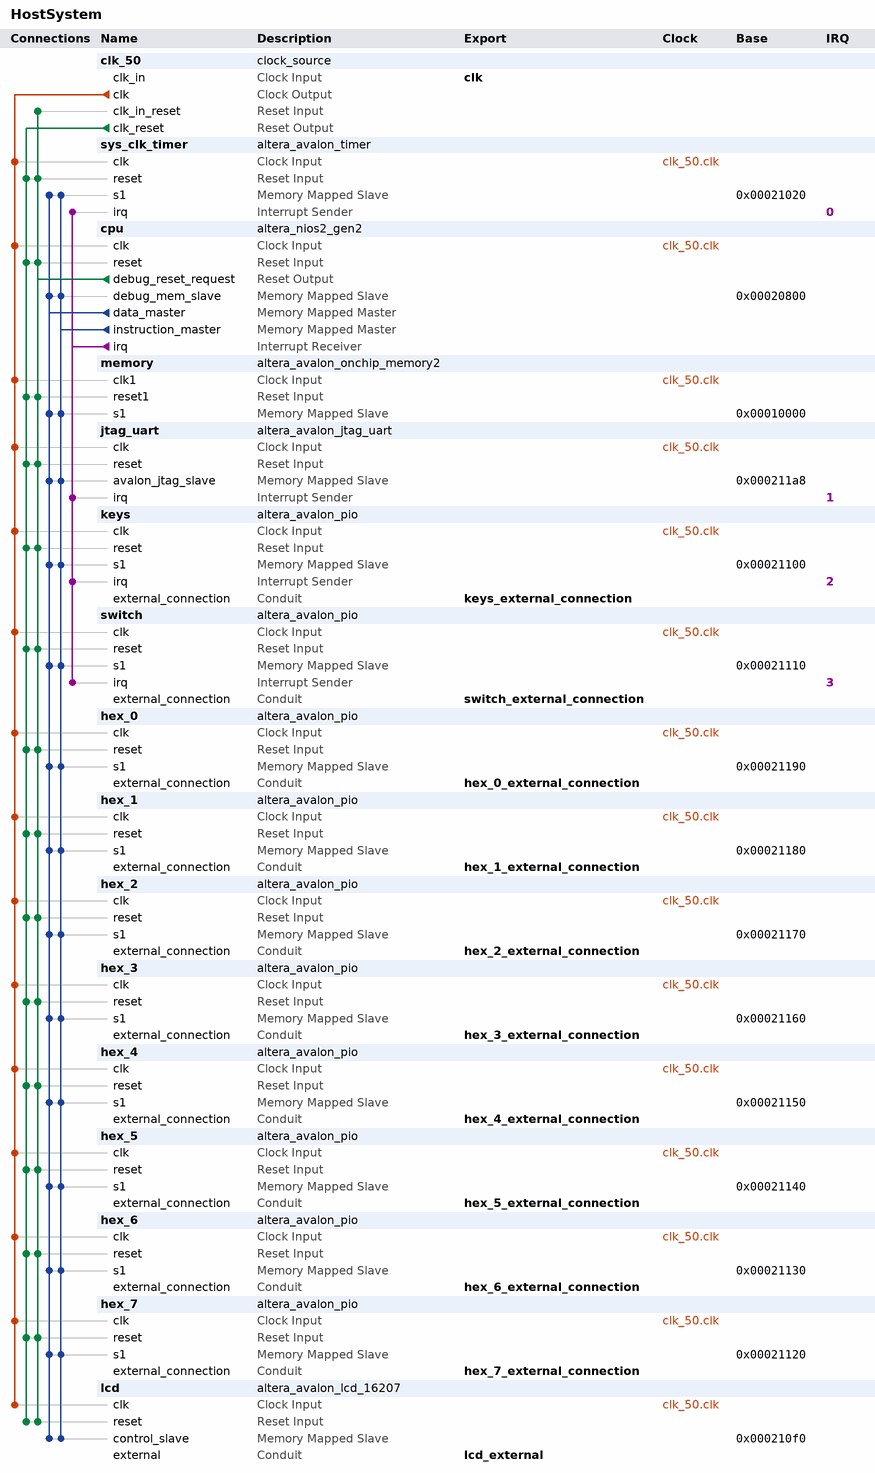
[diagram p0: system contents]
# Platform Designer (Qsys) system HostSystem, Cyclone IV E EP4CE115F29C7
# Parameters at their usual value, and those the tool derives, are not listed.
package require -exact qsys 18.0
create_system HostSystem
set_project_property DEVICE_FAMILY {Cyclone IV E}
set_project_property DEVICE EP4CE115F29C7

add_instance clk_50 clock_source 18.0
set_instance_parameter_value clk_50 clockFrequency 50000000

add_instance sys_clk_timer altera_avalon_timer 18.0
set_instance_parameter_value sys_clk_timer period 1
set_instance_parameter_value sys_clk_timer periodUnits MSEC

add_instance cpu altera_nios2_gen2 18.0
set_instance_parameter_value cpu dcache_size 2048
set_instance_parameter_value cpu exceptionSlave memory.s1
set_instance_parameter_value cpu icache_size 4096
set_instance_parameter_value cpu impl Tiny
set_instance_parameter_value cpu resetSlave memory.s1

add_instance memory altera_avalon_onchip_memory2 18.0
set_instance_parameter_value memory dataWidth 32
set_instance_parameter_value memory dualPort false
set_instance_parameter_value memory initMemContent true
set_instance_parameter_value memory initializationFileName onchip_mem.hex
set_instance_parameter_value memory memorySize 65536

add_instance jtag_uart altera_avalon_jtag_uart 18.0
set_instance_parameter_value jtag_uart simInteractiveOptions NO_INTERACTIVE_WINDOWS

add_instance keys altera_avalon_pio 18.0
set_instance_parameter_value keys direction Input
set_instance_parameter_value keys generateIRQ true
set_instance_parameter_value keys width 4

add_instance switch altera_avalon_pio 18.0
set_instance_parameter_value switch direction Input
set_instance_parameter_value switch generateIRQ true
set_instance_parameter_value switch width 18

add_instance hex_0 altera_avalon_pio 18.0
set_instance_parameter_value hex_0 direction Output
set_instance_parameter_value hex_0 resetValue 5
set_instance_parameter_value hex_0 width 8

add_instance hex_1 altera_avalon_pio 18.0
set_instance_parameter_value hex_1 direction Output
set_instance_parameter_value hex_1 resetValue 5
set_instance_parameter_value hex_1 width 8

add_instance hex_2 altera_avalon_pio 18.0
set_instance_parameter_value hex_2 direction Output
set_instance_parameter_value hex_2 resetValue 5
set_instance_parameter_value hex_2 width 8

add_instance hex_3 altera_avalon_pio 18.0
set_instance_parameter_value hex_3 direction Output
set_instance_parameter_value hex_3 resetValue 5
set_instance_parameter_value hex_3 width 8

add_instance hex_4 altera_avalon_pio 18.0
set_instance_parameter_value hex_4 direction Output
set_instance_parameter_value hex_4 resetValue 5
set_instance_parameter_value hex_4 width 8

add_instance hex_5 altera_avalon_pio 18.0
set_instance_parameter_value hex_5 direction Output
set_instance_parameter_value hex_5 resetValue 5
set_instance_parameter_value hex_5 width 8

add_instance hex_6 altera_avalon_pio 18.0
set_instance_parameter_value hex_6 direction Output
set_instance_parameter_value hex_6 resetValue 5
set_instance_parameter_value hex_6 width 8

add_instance hex_7 altera_avalon_pio 18.0
set_instance_parameter_value hex_7 direction Output
set_instance_parameter_value hex_7 resetValue 5
set_instance_parameter_value hex_7 width 8

add_instance lcd altera_avalon_lcd_16207 18.0

# connections
add_connection clk_50.clk cpu.clk clock
add_connection clk_50.clk hex_0.clk clock
add_connection clk_50.clk hex_1.clk clock
add_connection clk_50.clk hex_2.clk clock
add_connection clk_50.clk hex_3.clk clock
add_connection clk_50.clk hex_4.clk clock
add_connection clk_50.clk hex_5.clk clock
add_connection clk_50.clk hex_6.clk clock
add_connection clk_50.clk hex_7.clk clock
add_connection clk_50.clk jtag_uart.clk clock
add_connection clk_50.clk keys.clk clock
add_connection clk_50.clk lcd.clk clock
add_connection clk_50.clk memory.clk1 clock
add_connection clk_50.clk switch.clk clock
add_connection clk_50.clk sys_clk_timer.clk clock
add_connection clk_50.clk_reset cpu.reset reset
add_connection clk_50.clk_reset hex_0.reset reset
add_connection clk_50.clk_reset hex_1.reset reset
add_connection clk_50.clk_reset hex_2.reset reset
add_connection clk_50.clk_reset hex_3.reset reset
add_connection clk_50.clk_reset hex_4.reset reset
add_connection clk_50.clk_reset hex_5.reset reset
add_connection clk_50.clk_reset hex_6.reset reset
add_connection clk_50.clk_reset hex_7.reset reset
add_connection clk_50.clk_reset jtag_uart.reset reset
add_connection clk_50.clk_reset keys.reset reset
add_connection clk_50.clk_reset lcd.reset reset
add_connection clk_50.clk_reset memory.reset1 reset
add_connection clk_50.clk_reset switch.reset reset
add_connection clk_50.clk_reset sys_clk_timer.reset reset
add_connection cpu.debug_reset_request clk_50.clk_in_reset reset
add_connection cpu.debug_reset_request cpu.reset reset
add_connection cpu.debug_reset_request hex_0.reset reset
add_connection cpu.debug_reset_request hex_1.reset reset
add_connection cpu.debug_reset_request hex_2.reset reset
add_connection cpu.debug_reset_request hex_3.reset reset
add_connection cpu.debug_reset_request hex_4.reset reset
add_connection cpu.debug_reset_request hex_5.reset reset
add_connection cpu.debug_reset_request hex_6.reset reset
add_connection cpu.debug_reset_request hex_7.reset reset
add_connection cpu.debug_reset_request jtag_uart.reset reset
add_connection cpu.debug_reset_request keys.reset reset
add_connection cpu.debug_reset_request lcd.reset reset
add_connection cpu.debug_reset_request memory.reset1 reset
add_connection cpu.debug_reset_request switch.reset reset
add_connection cpu.debug_reset_request sys_clk_timer.reset reset
add_connection cpu.data_master cpu.debug_mem_slave avalon
set_connection_parameter_value cpu.data_master/cpu.debug_mem_slave baseAddress 0x00020800
add_connection cpu.data_master hex_0.s1 avalon
set_connection_parameter_value cpu.data_master/hex_0.s1 baseAddress 0x00021190
add_connection cpu.data_master hex_1.s1 avalon
set_connection_parameter_value cpu.data_master/hex_1.s1 baseAddress 0x00021180
add_connection cpu.data_master hex_2.s1 avalon
set_connection_parameter_value cpu.data_master/hex_2.s1 baseAddress 0x00021170
add_connection cpu.data_master hex_3.s1 avalon
set_connection_parameter_value cpu.data_master/hex_3.s1 baseAddress 0x00021160
add_connection cpu.data_master hex_4.s1 avalon
set_connection_parameter_value cpu.data_master/hex_4.s1 baseAddress 0x00021150
add_connection cpu.data_master hex_5.s1 avalon
set_connection_parameter_value cpu.data_master/hex_5.s1 baseAddress 0x00021140
add_connection cpu.data_master hex_6.s1 avalon
set_connection_parameter_value cpu.data_master/hex_6.s1 baseAddress 0x00021130
add_connection cpu.data_master hex_7.s1 avalon
set_connection_parameter_value cpu.data_master/hex_7.s1 baseAddress 0x00021120
add_connection cpu.data_master jtag_uart.avalon_jtag_slave avalon
set_connection_parameter_value cpu.data_master/jtag_uart.avalon_jtag_slave baseAddress 0x000211a8
add_connection cpu.data_master keys.s1 avalon
set_connection_parameter_value cpu.data_master/keys.s1 baseAddress 0x00021100
add_connection cpu.data_master lcd.control_slave avalon
set_connection_parameter_value cpu.data_master/lcd.control_slave baseAddress 0x000210f0
add_connection cpu.data_master memory.s1 avalon
set_connection_parameter_value cpu.data_master/memory.s1 baseAddress 0x00010000
add_connection cpu.data_master switch.s1 avalon
set_connection_parameter_value cpu.data_master/switch.s1 baseAddress 0x00021110
add_connection cpu.data_master sys_clk_timer.s1 avalon
set_connection_parameter_value cpu.data_master/sys_clk_timer.s1 baseAddress 0x00021020
add_connection cpu.instruction_master cpu.debug_mem_slave avalon
set_connection_parameter_value cpu.instruction_master/cpu.debug_mem_slave baseAddress 0x00020800
add_connection cpu.instruction_master hex_0.s1 avalon
set_connection_parameter_value cpu.instruction_master/hex_0.s1 baseAddress 0x00021190
add_connection cpu.instruction_master hex_1.s1 avalon
set_connection_parameter_value cpu.instruction_master/hex_1.s1 baseAddress 0x00021180
add_connection cpu.instruction_master hex_2.s1 avalon
set_connection_parameter_value cpu.instruction_master/hex_2.s1 baseAddress 0x00021170
add_connection cpu.instruction_master hex_3.s1 avalon
set_connection_parameter_value cpu.instruction_master/hex_3.s1 baseAddress 0x00021160
add_connection cpu.instruction_master hex_4.s1 avalon
set_connection_parameter_value cpu.instruction_master/hex_4.s1 baseAddress 0x00021150
add_connection cpu.instruction_master hex_5.s1 avalon
set_connection_parameter_value cpu.instruction_master/hex_5.s1 baseAddress 0x00021140
add_connection cpu.instruction_master hex_6.s1 avalon
set_connection_parameter_value cpu.instruction_master/hex_6.s1 baseAddress 0x00021130
add_connection cpu.instruction_master hex_7.s1 avalon
set_connection_parameter_value cpu.instruction_master/hex_7.s1 baseAddress 0x00021120
add_connection cpu.instruction_master jtag_uart.avalon_jtag_slave avalon
set_connection_parameter_value cpu.instruction_master/jtag_uart.avalon_jtag_slave baseAddress 0x000211a8
add_connection cpu.instruction_master keys.s1 avalon
set_connection_parameter_value cpu.instruction_master/keys.s1 baseAddress 0x00021100
add_connection cpu.instruction_master lcd.control_slave avalon
set_connection_parameter_value cpu.instruction_master/lcd.control_slave baseAddress 0x000210f0
add_connection cpu.instruction_master memory.s1 avalon
set_connection_parameter_value cpu.instruction_master/memory.s1 baseAddress 0x00010000
add_connection cpu.instruction_master switch.s1 avalon
set_connection_parameter_value cpu.instruction_master/switch.s1 baseAddress 0x00021110
add_connection cpu.instruction_master sys_clk_timer.s1 avalon
set_connection_parameter_value cpu.instruction_master/sys_clk_timer.s1 baseAddress 0x00021020
add_connection cpu.irq jtag_uart.irq interrupt
set_connection_parameter_value cpu.irq/jtag_uart.irq irqNumber 1
add_connection cpu.irq keys.irq interrupt
set_connection_parameter_value cpu.irq/keys.irq irqNumber 2
add_connection cpu.irq switch.irq interrupt
set_connection_parameter_value cpu.irq/switch.irq irqNumber 3
add_connection cpu.irq sys_clk_timer.irq interrupt
set_connection_parameter_value cpu.irq/sys_clk_timer.irq irqNumber 0

# exported interfaces
add_interface clk clock sink
set_interface_property clk EXPORT_OF clk_50.clk_in
add_interface hex_0_external_connection conduit end
set_interface_property hex_0_external_connection EXPORT_OF hex_0.external_connection
add_interface hex_1_external_connection conduit end
set_interface_property hex_1_external_connection EXPORT_OF hex_1.external_connection
add_interface hex_2_external_connection conduit end
set_interface_property hex_2_external_connection EXPORT_OF hex_2.external_connection
add_interface hex_3_external_connection conduit end
set_interface_property hex_3_external_connection EXPORT_OF hex_3.external_connection
add_interface hex_4_external_connection conduit end
set_interface_property hex_4_external_connection EXPORT_OF hex_4.external_connection
add_interface hex_5_external_connection conduit end
set_interface_property hex_5_external_connection EXPORT_OF hex_5.external_connection
add_interface hex_6_external_connection conduit end
set_interface_property hex_6_external_connection EXPORT_OF hex_6.external_connection
add_interface hex_7_external_connection conduit end
set_interface_property hex_7_external_connection EXPORT_OF hex_7.external_connection
add_interface keys_external_connection conduit end
set_interface_property keys_external_connection EXPORT_OF keys.external_connection
add_interface lcd_external conduit end
set_interface_property lcd_external EXPORT_OF lcd.external
add_interface switch_external_connection conduit end
set_interface_property switch_external_connection EXPORT_OF switch.external_connection

set_interconnect_requirement {$system} qsys_mm.clockCrossingAdapter HANDSHAKE
set_interconnect_requirement {$system} qsys_mm.enableEccProtection FALSE
set_interconnect_requirement {$system} qsys_mm.insertDefaultSlave FALSE
set_interconnect_requirement {$system} qsys_mm.maxAdditionalLatency 1

save_system HostSystem.qsys
